# EAGLE design Version1 (EAGLE 6.2)
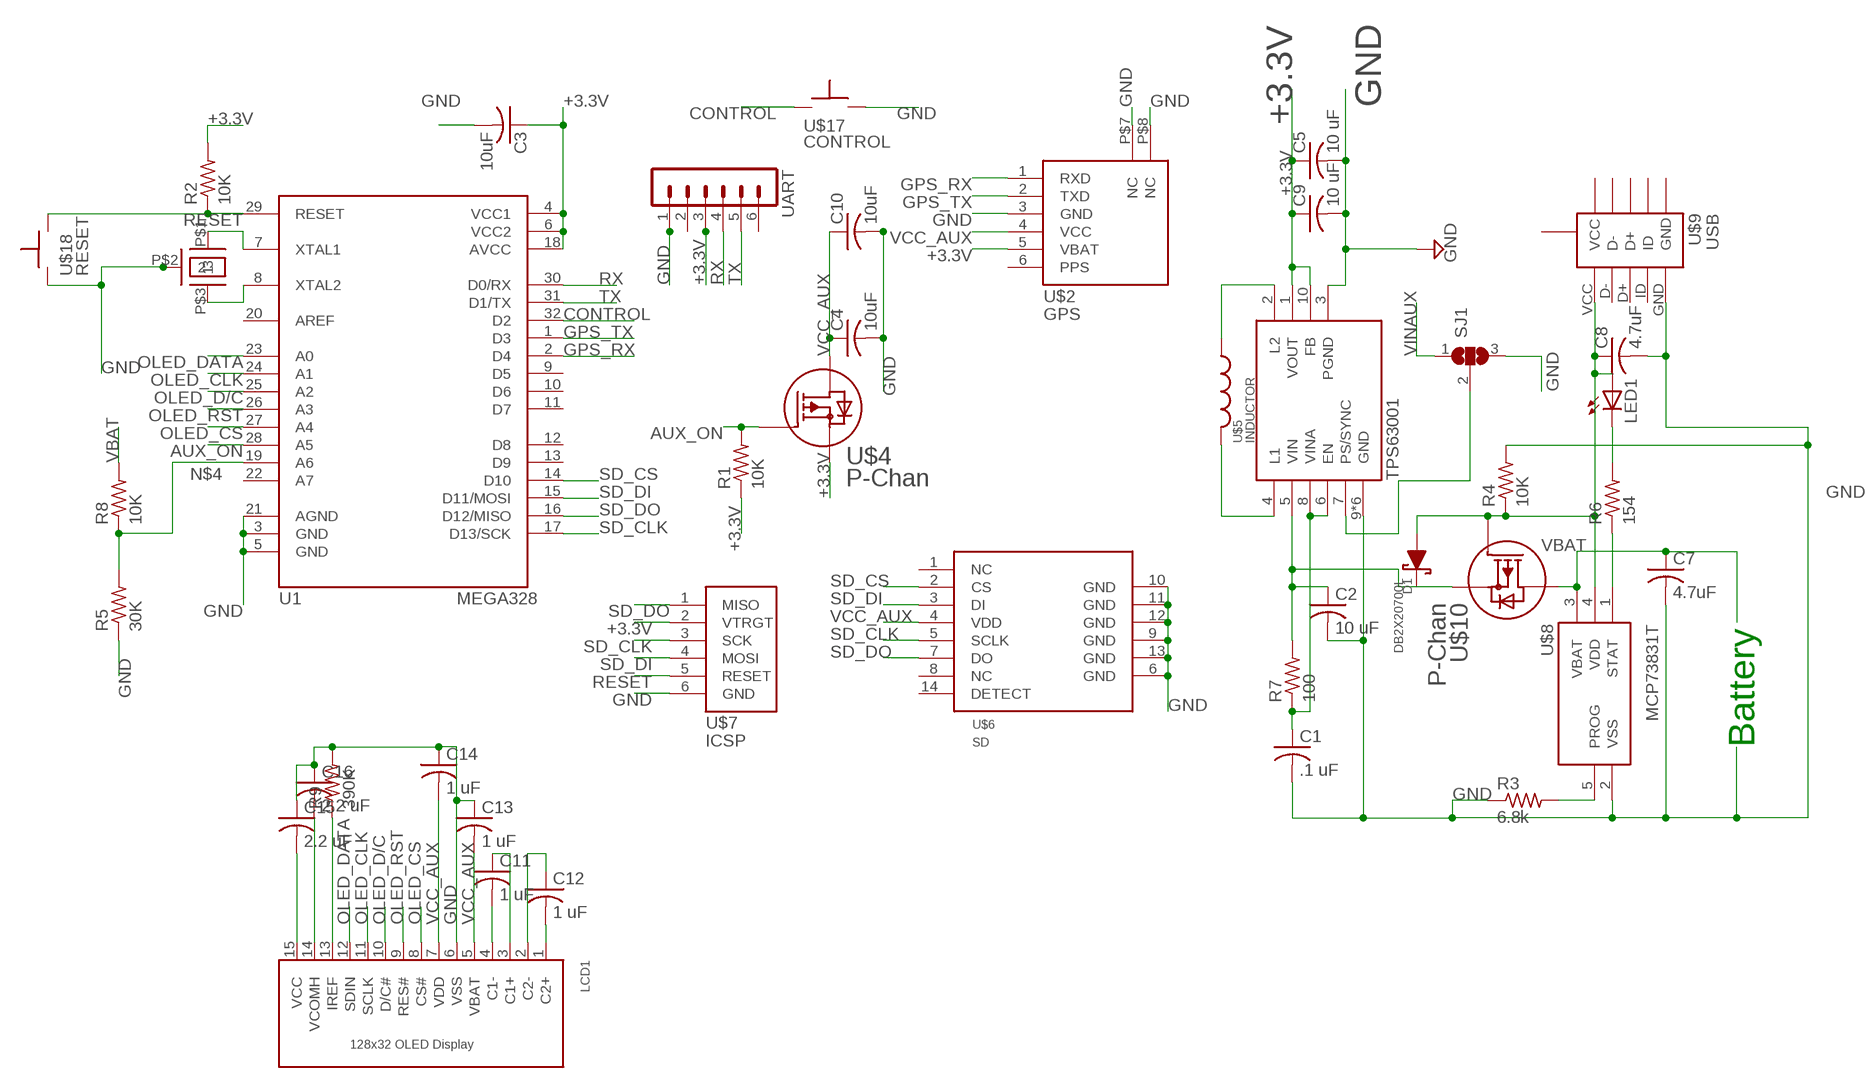
[diagram p0: schematic, sheet 1]

## Parts
C1  .1 uF  C-USC0603  [C0603]
C2  10 uF  C-USC0603  [C0603]
C3  10uF  C-USC0603  [C0603]
C4  10uF  C-USC0603  [C0603]
C5  10 uF  C-USC0603  [C0603]
C7  4.7uF  C-USC0603  [C0603]
C8  4.7uF  C-USC0603  [C0603]
C9  10 uF  C-USC0603  [C0603]
C10  10uF  C-USC0603  [C0603]
C11  1 uF  C-USC0805  [C0805]
C12  1 uF  C-USC0805  [C0805]
C13  1 uF  C-USC0805  [C0805]
C14  1 uF  C-USC0805  [C0805]
C15  2.2 uF  C-USC0805  [C0805]
C16  2.2 uF  C-USC0805  [C0805]
D1  DB2X20700L  DIODE-PANASONIC-DB2X20700LMINI2-F4-B  [MINI2-F4-B_DIODE]
LCD1  DISP_OLED_UG-2832HSWEG04WRAPAROUND  [UG-2832HSWEG04_WRAPAROUND]
LED1  LEDSMT1206  [1206]
R1  10K  R-US_R0805  [R0805]
R2  10K  R-US_R0805  [R0805]
R3  6.8k  R-US_R0805  [R0805]
R4  10K  R-US_R0805  [R0805]
R5  30K  R-US_R0805  [R0805]
R6  154  R-US_R0805  [R0805]
R7  100  R-US_R0603  [R0603]
R8  10K  R-US_R0805  [R0805]
R9  390K  R-US_R0805  [R0805]
SJ1  SJ2W  [SJ_2]
U1  MEGA328  ATMEGA328-TQFP32-ARDUINOARDUINO-LABELS  [MEGA328-TQFP32]
U$2  GPS  FASTRAX_UP501_GPS  [FASTRAX_GPS]
U$3  TPS63001  TPS63001-3.3V-BUCK/BOOSTSON-10  [SON-10]
U$4  P-Chan  NXP-MOSFET-PMV160UP,215  [SOT-23]
U$5  INDUCTOR  VLS3015-INDUCTORVLS-SERIES  [VLS3015E-INDUCTOR]
U$6  SD  MOLEX_MICROSD_502702-0891JAE  [JA-MICROSD-ST9S008V4AR1500]
U$7  ICSP  MOLEX2.54MM-6PIN-2X3ICSP  [2.54MM2X3]
U$8  MCP73831T  MICROCHIP-MCP73831-LIPO-CHARGERSOT-23-5  [SOT-23-5]
U$9  USB  MOLEX-MICRO-USB47346-0001  [MOLEX-MICRO-USB-47346-0001]
U$10  P-Chan  NXP-MOSFET-PMV160UP,215  [SOT-23]
U$12  OSC  MURATA-RESONATOR  [MURATA-8MHZ-RESONATOR]
U$17  CONTROL  SWITCH-OMRON-B3U-3000P  [SWITCH-SMALL]
U$18  RESET  SWITCH-OMRON-B3U-3000P  [SWITCH-SMALL]
UART  MA06-1  [MA06-1]

## Nets
+3.3V: C3.1 C5.1 C9.1 R1.1 R2.2 U1.4(VCC1) U1.6(VCC2) U1.18(AVCC) U$2.5(VBAT) U$3.1(VOUT) U$3.10(FB) U$4.2(SOURCE) U$7.2(VTRGT) UART.3
AUX_ON: R1.2 U1.28(A5) U$4.1(GATE)
CONTROL: U1.32(D2) U$17.P$1
GND: C1.2 C2.2 C3.2 C4.2 C5.2 C7.2 C8.2 C9.2 C10.2 C13.1 C14.1 C15.1 C16.1 LCD1.6(VSS) R3.1 R4.2 R5.1 R9.2 SJ1.3 U1.3(GND) U1.5(GND) U1.21(AGND) U$2.3(GND) U$2.P$7(NC) U$2.P$8(NC) U$3.3(PGND) U$3.9(GND) U$3.11(GND) U$3.12(GND) U$3.13(GND) U$3.14(GND) U$3.P$1(GND) U$6.6(GND) U$6.9(GND) U$6.10(GND) U$6.11(GND) U$6.12(GND) U$6.13(GND) U$7.6(GND) U$8.2(VSS) U$9.GND U$12.P$2 U$17.P$2 U$18.P$1 UART.1
GPS_RX: U1.2(D4) U$2.1(RXD)
GPS_TX: U1.1(D3) U$2.2(TXD)
L1: U$3.4(L1) U$5.1
L2: U$3.2(L2) U$5.2
N$1: R3.2 U$8.5(PROG)
N$2: U1.7(XTAL1) U$12.P$1
N$3: U1.8(XTAL2) U$12.P$3
N$4: R5.2 R8.1 U1.19(A6)
N$5: C11.2 LCD1.4(C1-)
N$6: C11.1 LCD1.3(C1+)
N$7: SJ1.2 U$3.7(PS/SYNC)
N$8: C12.1 LCD1.2(C2-)
N$9: C12.2 LCD1.1(C2+)
N$10: C15.2 LCD1.15(VCC)
N$11: C16.2 LCD1.14(VCOMH)
N$13: LCD1.13(IREF) R9.1
N$17: LED1.C R6.2
N$19: R6.1 U$8.1(STAT)
OLED_CLK: LCD1.11(SCLK) U1.24(A1)
OLED_CS: LCD1.8(CS#) U1.27(A4)
OLED_D/C: LCD1.10(D/C#) U1.25(A2)
OLED_DATA: LCD1.12(SDIN) U1.23(A0)
OLED_RST: LCD1.9(RES#) U1.26(A3)
RESET: R2.1 U1.29(RESET) U$7.5(RESET) U$18.P$2
RX: U1.30(D0/RX) UART.4
SD_CLK: U1.17(D13/SCK) U$6.5(SCLK) U$7.3(SCK)
SD_CS: U1.14(D10) U$6.2(CS)
SD_DI: U1.15(D11/MOSI) U$6.3(DI) U$7.4(MOSI)
SD_DO: U1.16(D12/MISO) U$6.7(DO) U$7.1(MISO)
TX: U1.31(D1/TX) UART.5
VBAT: C7.1 R8.2 U$8.3(VBAT) U$10.3(DRAIN)
VCC_AUX: C4.1 C10.1 C13.2 C14.2 LCD1.5(VBAT) LCD1.7(VDD) U$2.4(VCC) U$4.3(DRAIN) U$6.4(VDD)
VDD: C8.1 D1.ANODE(A) LED1.A R4.1 U$8.4(VDD) U$9.VCC U$10.1(GATE)
VIN: C2.1 D1.CATHODE(K) R7.2 U$3.5(VIN) U$10.2(SOURCE)
VINAUX: C1.1 R7.1 SJ1.1 U$3.6(EN) U$3.8(VINA)
Unconnected: U1.9(D5) U1.10(D6) U1.11(D7) U1.12(D8) U1.13(D9) U1.20(AREF) U1.22(A7) U$2.6(PPS) U$6.1(NC) U$6.8(NC) U$6.14(DETECT) U$9.D+ U$9.D- U$9.GND@6(GND) U$9.GND@7(GND) U$9.GND@8(GND) U$9.GND@9(GND) U$9.GND@10(GND) U$9.GND@11(GND) U$9.ID UART.2 UART.6

## Notes on the sheet
- Battery

## Library data of the parts
C1-C5 C7-C10 = rcl:C-US: CAPACITOR, American symbol
C11-C16 = resistor:C-US: CAPACITOR, American symbol
D1 = Saleem_lib:DIODE-PANASONIC-DB2X20700L
LCD1 = microbuilder:DISP_OLED_UG-2832HSWEG04: 128x32 SPI 0.91" Monochrome OLED Display
LED1 = led:LED: LED OSRAM: - CHIPLED LG R971, LG N971, LY N971, LG Q971, LY Q971, LO R971, LY R971 LH N974, LH R974 LS Q976, LO Q976, LY Q976 LO Q996 - Hyper CHIPLED LW Q18S LB Q993, LB Q99A, LB R99A - SideLED LS A670, LO A670, LY A670, LG A670, LP A670 LB A673, LV A673, LT A673, LW A673 LH A674 LY A675 LS A676, LA A676, LO A676, LY A676, LW A676 LS A679, LY A679, LG A679 - Hyper Micro SIDELED® LS Y876, LA Y876, LO Y876, LY Y876 LT Y87S - SmartLED LW L88C, LW L88S LB L89C, LB L89S, LG L890 LS L89K, LO L89K, LY L89K LS L896, LA L896, LO L896, LY L896 - TOPLED LS T670, LO T670, LY T670, LG T670, LP T670 LSG T670, LSP T670, LSY T670, LOP T670, LYG T670 LG T671, LOG T671, LSG T671 LB T673, LV T673, LT T673, LW T673 LH T674 LS T676, LA T676, LO T676, LY T676, LB T676, LH T676, LSB T676, LW T676 LB T67C, LV T67C, LT T67C, LS T67K, LO T67K, LY T67K, LW E67C LS E67B, LA E67B, LO E67B, LY E67B, LB E67C, LV E67C, LT E67C LW T67C LS T679, LY T679, LG T679 LS T770, LO T770, LY T770, LG T770, LP T770 LB T773, LV T773, LT T773, LW T773 LH T774 LS E675, LA E675, LY E675, LS T675 LS T776, LA T776, LO T776, LY T776, LB T776 LHGB T686 LT T68C, LB T68C - Hyper Mini TOPLED® LB M676 - Mini TOPLED Santana® LG M470 LS M47K, LO M47K, LY M47K Source: http://www.osram.convergy.de LUXEON: - LUMILED® LXK2-PW12-R00, LXK2-PW12-S00, LXK2-PW14-U00, LXK2-PW14-V00 LXK2-PM12-R00, LXK2-PM12-S00, LXK2-PM14-U00 LXK2-PE12-Q00, LXK2-PE12-R00, LXK2-PE12-S00, LXK2-PE14-T00, LXK2-PE14-U00 LXK2-PB12-K00, LXK2-PB12-L00, LXK2-PB12-M00, LXK2-PB14-N00, LXK2-PB14-P00, LXK2-PB14-Q00 LXK2-PR12-L00, LXK2-PR12-M00, LXK2-PR14-Q00, LXK2-PR14-R00 LXK2-PD12-Q00, LXK2-PD12-R00, LXK2-PD12-S00 LXK2-PH12-R00, LXK2-PH12-S00 LXK2-PL12-P00, LXK2-PL12-Q00, LXK2-PL12-R00 Source: www.luxeon.com KINGBRIGHT: KA-3528ASYC Source: www.kingbright.com
R1-R8 = resistor:R-US_: RESISTOR, American symbol
R9 = adafruit:R-US_: RESISTOR, American symbol
SJ1 = jumper:SJ2W: SMD solder JUMPER
U1 = Saleem_lib:ATMEGA328-TQFP32-ARDUINO: 556-ATMEGA328P-AU
U$2 = Saleem_lib:FASTRAX_UP501_GPS
U$3 = Saleem_lib:TPS63001-3.3V-BUCK/BOOST
U$4 U$10 = Saleem_lib:NXP-MOSFET-PMV160UP,215
U$5 = Saleem_lib:VLS3015-INDUCTOR
U$6 = Saleem_lib:MOLEX_MICROSD_502702-0891
U$7 = Saleem_lib:MOLEX2.54MM-6PIN-2X3
U$8 = Saleem_lib:MICROCHIP-MCP73831-LIPO-CHARGER
U$9 = Saleem_lib:MOLEX-MICRO-USB
U$12 = Saleem_lib:MURATA-RESONATOR
U$17 U$18 = Saleem_lib:SWITCH-OMRON-B3U-3000P
UART = con-lstb:MA06-1: PIN HEADER; OC_FARNELL: unknown; OC_NEWARK: unknown

## Board
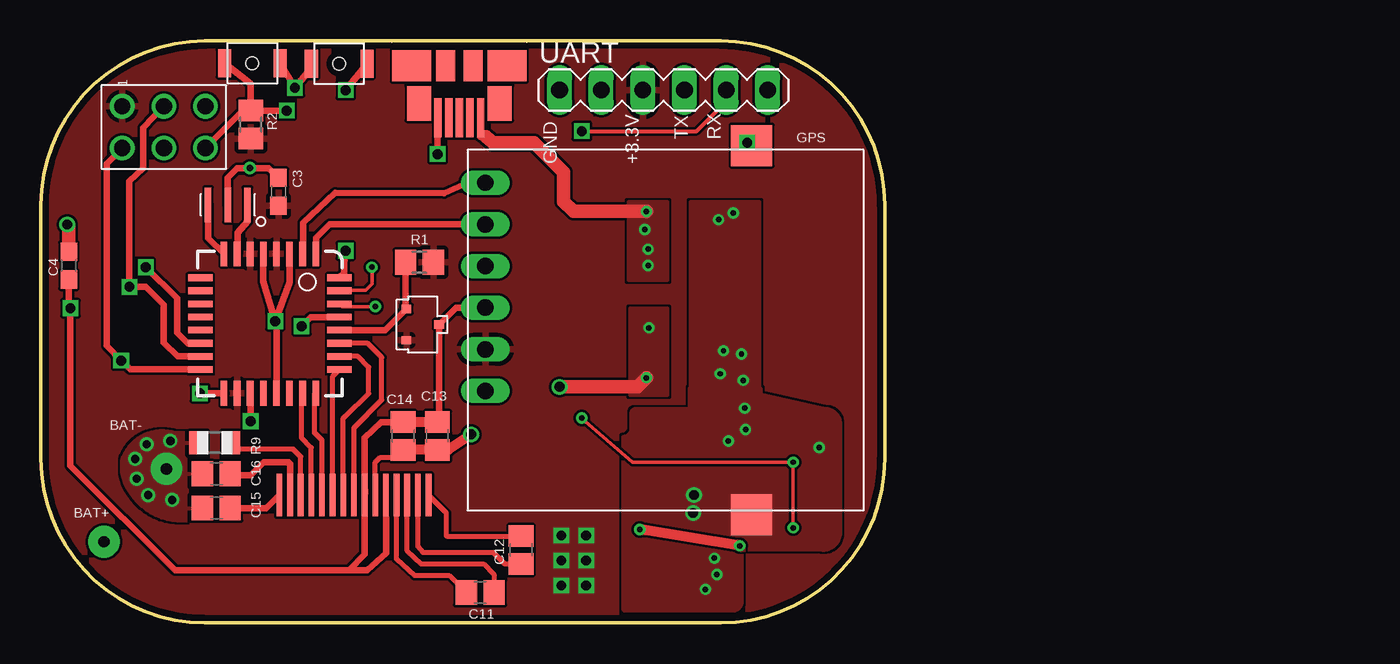
[diagram p1: board, top side]
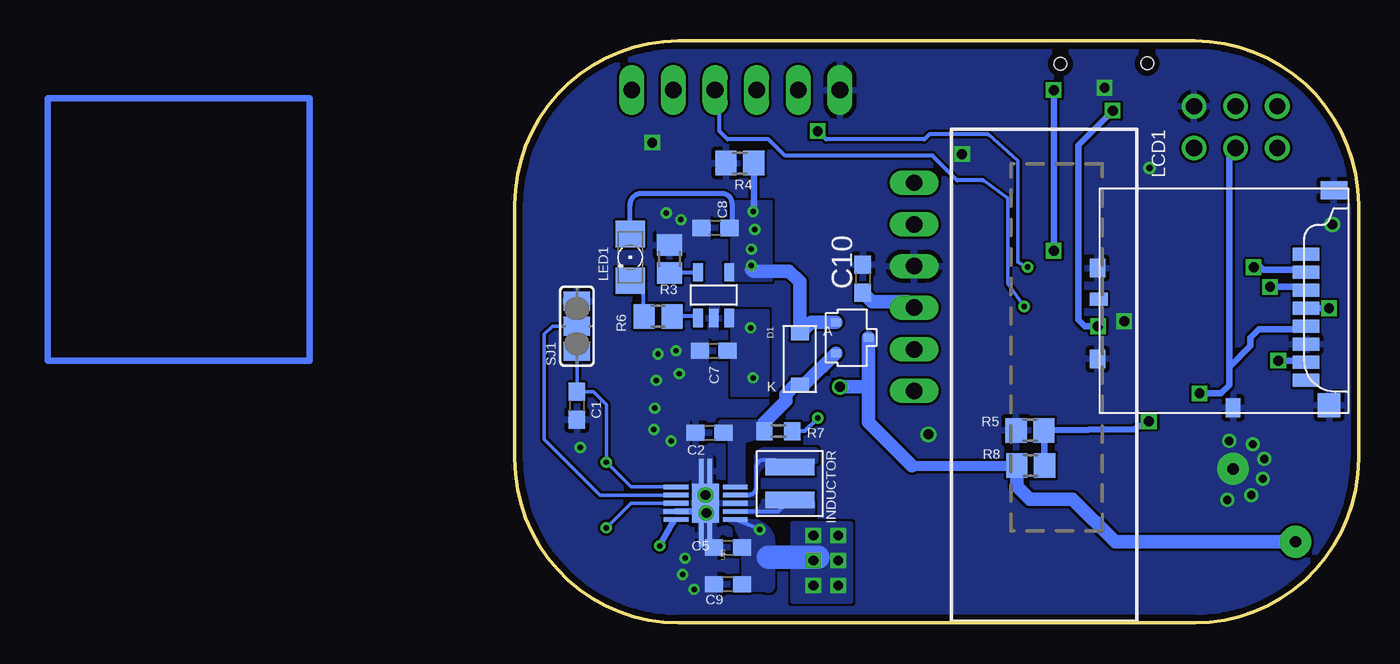
[diagram p2: board, bottom side, seen from below]

Size 51.5 x 35.5 mm. Coordinates in mm from the lower left corner, seen from the top.
Outline: 41.5,35.5 10,35.5 arc90 0,25.5 0,10 arc90 10,0 41.5,0 arc90 51.5,10 51.5,25.5 arc90 41.5,35.5
Copper layers (1*16): Top 0.0356mm / dielectric 1.5011mm / Bottom 0.0356mm
Design rules: minimum track width 6mil, minimum drill 13mil, track to track 6mil, track to pad 6mil, pad to pad 6mil, via to via 6mil, smd to smd 6mil, copper to edge 15mil, drill to drill 6mil, minimum pad ring 7mil, minimum via ring 7mil, stop-mask expansion 0mil, vias tented up to drill 24mil, thermal gap 10mil

### Footprints (pad centres in the part's own frame; a part is rotated, then mirrored left to right if it is on the bottom)
C0603 = smd 1.1 x 1: 1 -0.85,0; 2 0.85,0
C0805 = smd 1.3 x 1.5: 1 -0.85,0; 2 0.85,0
MINI2-F4-B_DIODE = smd 1.1 x 0.8: ANODE 0,-1.55; CATHODE 0,1.55
UG-2832HSWEG04_WRAPAROUND = smd 2.6 x 0.35 bottom: 1 -7.7,-4.55; 2 -7.7,-3.9; 3 -7.7,-3.25; 4 -7.7,-2.6; 5 -7.7,-1.95; 6 -7.7,-1.3; 7 -7.7,-0.65; 8 -7.7,0; 9 -7.7,0.65; 10 -7.7,1.3; 11 -7.7,1.95; 12 -7.7,2.6; 13 -7.7,3.25; 14 -7.7,3.9; 15 -7.7,4.55
1206 = smd 1.6 x 1.803: A -1.422,0; C 1.422,0
R0805 = smd 1.3 x 1.5: 1 -0.85,0; 2 0.85,0
R0603 = smd 1 x 1.1: 1 -0.85,0; 2 0.85,0
R0805' = smd 1.1 x 1.4: 1 -1,0; 2 1,0
SJ_2 = smd 1.168 x 1.6: 1 -1.524,0; 2 0,0; 3 1.524,0
MEGA328-TQFP32 = smd 1.5 x 0.406: 1 -4.25,2.8; 2 -4.25,2; 3 -4.25,1.2; 4 -4.25,0.4; 5 -4.25,-0.4; 6 -4.25,-1.2; 7 -4.25,-2; 8 -4.25,-2.8; 17 4.25,-2.8; 18 4.25,-2; 19 4.25,-1.2; 20 4.25,-0.4; 21 4.25,0.4; 22 4.25,1.2; 23 4.25,2; 24 4.25,2.8 | smd 0.406 x 1.5: 9 -2.8,-4.25; 10 -2,-4.25; 11 -1.2,-4.25; 12 -0.4,-4.25; 13 0.4,-4.25; 14 1.2,-4.25; 15 2,-4.25; 16 2.8,-4.25; 25 2.8,4.25; 26 2,4.25; 27 1.2,4.25; 28 0.4,4.25; 29 -0.4,4.25; 30 -1.2,4.25; 31 -2,4.25; 32 -2.8,4.25
FASTRAX_GPS = drill 1 long: 1 11.43,-8.89; 2 11.43,-6.35; 3 11.43,-3.81; 4 11.43,-1.27; 5 11.43,1.27; 6 11.43,3.81 | smd 2.5 x 2.5: P$7 -4.82,11.35; P$8 -4.82,-11.16
SON-10 = smd 0.28 x 1.5: 1 -1,-1.8; 2 -0.5,-1.8; 3 0,-1.8; 4 0.5,-1.8; 5 1,-1.8; 6 1,1.8; 7 0.5,1.8; 8 0,1.8; 9 -0.5,1.8; 10 -1,1.8 | smd 1.5 x 0.28: 11 -1.95,0.25; 12 -1.95,-0.25; 13 1.95,0.25; 14 1.95,-0.25 | smd 2.4 x 1.65: P$1 0,0
SOT-23 = smd 0.5 x 0.6: 1 0.95,0.7; 2 -0.95,0.7; 3 0,-1.3
VLS3015E-INDUCTOR = smd 1 x 3: 1 -1,0; 2 1,0
JA-MICROSD-ST9S008V4AR1500 = smd 0.8 x 1.6: 1 3,-6.1; 2 1.9,-6.1; 3 0.8,-6.1; 4 -0.3,-6.1; 5 -1.4,-6.1; 6 -2.5,-6.1; 7 -3.6,-6.1; 8 -4.7,-6.1 | smd 1.45 x 1.4: 9 -6.225,-7.5 | smd 1.1 x 1.6: 10 6.9,-7.8 | smd 1.1 x 0.95: 11 -3.4,6.625; 12 2.15,6.625 | smd 1.15 x 0.9: 13 -6.375,-1.65 | smd 0.8 x 1.1: 14 0.25,6.55
2.54MM2X3 = drill 1: 1 -1.27,2.54; 2 1.27,2.54; 3 -1.27,0; 4 1.27,0; 5 -1.27,-2.54; 6 1.27,-2.54
SOT-23-5 = smd 0.6 x 1.1: 1 -0.95,0; 2 0,0; 3 0.95,0; 4 0.95,2.8; 5 -0.95,2.8
MOLEX-MICRO-USB-47346-0001 = smd 2.38 x 0.45: D+ 0.5,0; D- 0.5,0.65; GND 0.5,-1.3; ID 0.5,-0.65; VCC 0.5,1.3 | smd 2.1 x 1.475: GND@6 -0.36,2.462; GND@7 -0.36,-2.462 | smd 1.9 x 2.375: GND@8 -2.66,2.913; GND@11 -2.66,-2.913 | smd 1.9 x 1.175: GND@9 -2.66,0.838; GND@10 -2.66,-0.838
MURATA-8MHZ-RESONATOR = smd 0.4 x 2.1: P$1 -1.2,0; P$2 0,0; P$3 1.2,0
SWITCH-SMALL = smd 0.8 x 1.7: P$1 -1.7,0; P$2 1.7,0 | hole 0.75: 0,0
MA06-1 = drill 1.016 long: 1 -6.35,0; 2 -3.81,0; 3 -1.27,0; 4 1.27,0; 5 3.81,0; 6 6.35,0

### Placement (x,y rotation side)
C1  47.7,13.25 270 bottom
C2  39.6,11.6 180 bottom
C3  14.5,26.3 90 top
C4  1.7,21.8 90 top
C5  38.49,4.6 180 bottom
C7  39.35,16.6 180 bottom
C8  39.25,24.1 180 bottom
C9  38.47,2.36 180 bottom
C10  30.25,21 90 bottom
C11  26.8,1.85 180 top
C12  29.3,4.45 90 top
C13  24.2,11.4 90 top
C14  22.1,11.4 90 top
C15  10.7,7 0 top
C16  10.7,9.1 0 top
D1  34.1,16.1 180 bottom
LCD1  19.1,0.1 270 bottom
LED1  44.45,22.3 270 bottom
R1  23.1,22 180 top
R2  12.8,30.4 270 top
R3  42.05,22.2 270 bottom
R4  37.75,28.05 180 bottom
R5  20.05,11.75 0 bottom
R6  42.75,18.7 180 bottom
R7  35.4,11.7 180 bottom
R8  20,9.6 180 bottom
R9  390K  [R0805']  10.6,11 180 top
SJ1  47.7,18.1 90 bottom
U1  13.97,18.26 270 top
U$2  38.55,17.96 180 top
U$3  39.85,7.3 90 bottom
U$4  23,18.2 90 top
U$5  34.7,8.5 270 bottom
U$6  9.3,19.5 90 bottom
U$7  7.5,30.25 90 top
U$8  39.35,18.6 0 bottom
U$9  25.53,31.33 270 top
U$10  31.2,17.4 90 bottom
U$12  11.4,25.5 180 top
U$17  18.2,34.12 180 top
U$18  12.9,34.14 180 top
UART  38,32.5 0 top

### Tracks (layer width: path | path; a pad name or v marks a point on that pad's centre or on a via)
+3.3V  (via drill 0.33, 0.6)
  Top 0.61: v42.65,4.7 v36.55,5.7
  Bottom 0.152: U$3.10 41.86,6.3 41.86,6.1
  Bottom 0.254: v36.55,5.7 U$3.1
  Bottom 0.406: 41.85,6.1 41.86,6.1 v42.65,4.7
  Bottom 1.422: 33,4 36,4
  other vias: 31.75,5.33 31.75,3.81 31.75,2.29 33.27,5.33 33.27,3.81 33.27,2.29
  pour Top (rank 6): -0.5,22 -0.5,36 52,36 52,-0.5 -0.5,-0.5
  pour Bottom (no thermals): 38.35,6.25 37.05,6.2 arc90 35.75,4.9 35.78,2.17 arc90 36.1,1.99 37.28,2.02 arc90 37.49,2.14 37.5,5.45 arc90 37.7,5.25 37.9,5.65 arc-90 38.35,6.2
  pour Bottom: 34.54,1.27 34.54,6.1 30.99,6.1 30.99,1.27
AUX_ON
  Top 0.406: R1.2 22.25,19.2 U$4.1 21.01,17.86 U1.28
CONTROL  (via drill 0.6)
  Top 0.406: U1.32 18.36,21.2 18.5,21.3 18.5,21.9 v18.6,22.7 | v18.6,32.5 U$17.P$1
  Bottom 0.406: v18.6,22.7 v18.6,32.5
GND  (via drill 0.33, 0.4, 0.5 pad 0.41, 0.6, 0.7 pad 1.93)
  Top 0.305: LCD1.6 20.4,9.8 20.7,10.1 21.65,10.1 C14.1 | C13.1 24.85,10.55
  Top 0.406: U$2.P$8 43.19,29.3 v43.1,29.3 | 15.35,32.65 v15.5,32.65 | U$17.P$2 16.15,33.45 v15.5,32.65 | U$9.GND 24.2,31.3 v24.2,28.6 | U1.5 13.57,20.83 v14.3,18.4 | U1.3 15.17,20.77 v14.3,18.4 | U$12.P$2 11.4,27.17 11.98,27.75 v12.75,27.75 13.9,27.75 C3.2 | U1.21 14.37,18.33 v14.3,18.4 | U$18.P$1 v15.5,32.65
  Top 0.61: C13.1 C14.1 | 24.85,10.55 v26.25,11.5
  Top 0.813: C4.2 1.7,24.2 v1.6,24.3
  Bottom 0.406: U$3.9 39.85,6.8 U$3.P$1
  other vias: 42.85,14.8 42.75,16.4 41.65,16.6 42.25,25 41.35,24.6 41.45,15.2 43,11.8 42.95,13.1 41.95,11.1 39.85,7.8 39.8,6.7 41.1,3.95 41.25,2.95 40.55,2.05 47.5,10.7 7.65,9.4 7.9,11.1 8,7.5 6.45,10.9 5.75,10 5.85,8.8 6.55,7.8
  pour Bottom (no thermals): 39.15,18.2 39.15,17.5 39.75,17.5 39.75,13.9 43.85,13.9 43.85,17.7 39.65,17.7 39.65,18.2
  pour Bottom (no thermals): 39.55,19 39.55,22.7 42.75,22.7 42.75,25.7 39.65,25.7 39.65,23.2 39.05,23.2 39.05,19
  pour Top (isolate 0.254): 43.85,13.9 43.85,25.7 39.65,25.7 39.65,13.9
  pour Bottom (no thermals): 39.15,8.35 arc90 39.5,8.7 39.5,10.6 arc-90 39.6,10.7 40.85,10.7 arc90 40.9,10.75 40.9,15.55 arc-90 40.95,15.6 43.9,15.6 arc-90 43.95,15.55 44,10.35 42.2,10 arc90 40.6,9 40.6,8.45 arc-90 40.3,8.15 39.15,8.15
  pour Bottom (no thermals): 39.4,6.25 arc90 39.3,6.15 39.3,2.3 arc90 40.55,1.05 41.25,1.05 arc90 42.5,2.3 42.5,3.95 arc90 41.7,4.75 40.5,4.75 arc-90 40.2,5.05 40.2,6.15 arc90 39.35,6.25
  pour Top (no thermals): 36.05,12.8 arc-90 36.3,13.05 39.6,13.05 39.6,14.3 43.9,14.3 43.9,13.95 47.85,13.05 arc-90 48.75,12.15 48.75,5.5 arc-90 47.7,4.45 43,4.45 arc90 42.75,4.2 42.75,1.3 arc-90 42.2,0.75 35.65,0.75 arc-90 35.55,0.85 35.55,11.35 arc90 36.05,11.85
  pour Bottom (rank 6): -1,36.5 52.5,36.5 52.5,-1 -1,-1
  pour Top: 9.4,6.3 arc-90 4.95,9.2 4.95,9.9 arc-90 8.2,11.6 9.1,11.6
GPS_RX
  Top 0.406: U$2.1 26.05,26.85 24.6,26.2 17.95,26.25 16,24.4 16,22.51 U1.2
GPS_TX
  Top 0.406: U$2.2 17.61,24.31 16.8,23.5 16.8,22.54 U1.1
L1
  Bottom 0.254: U$3.4 37.25,7.8 arc-90 36.75,8.3 36.75,9.5 arc90 36.3,9.95 35.6,9.95 arc-90 35.15,9.5 U$5.1
  pour Bottom (no thermals): 37.2,7.75 37.1,7.75 arc-90 36.75,8.05 36.75,8.75 arc90 35.7,9.8 33.2,9.8 arc-90 33.05,9.95 33.05,10.45 arc-90 33.2,10.6 36.2,10.6 arc-90 36.8,10 36.8,8.15 arc90 37.1,7.85 37.2,7.85
L2
  Bottom 0.254: U$3.2 35.4,6.8 U$5.2
  pour Bottom (no thermals): 37.2,6.75 33.3,6.75 arc-90 33.25,6.8 33.25,7.3 arc-90 33.4,7.45 36.35,7.45 arc90 36.95,6.85 37.2,6.85 arc-90 37.25,6.8
N$1
  Bottom 0.203: 42.05,21.4 R3.2
  Bottom 0.254: 42.05,21.4 U$8.5
N$2
  Top 0.406: U1.7 12,22.58 12,23.8 12.6,24.5 U$12.P$1
N$3
  Top 0.406: U1.8 10.2,23.48 U$12.P$3
N$4  (via drill 0.6)
  Top 0.406: v12.8,12.3 12.8,13.98 U1.19
  Bottom 0.406: R8.1 R5.2 13.7,11.8 v12.8,12.3
N$5
  Top 0.305: C11.2 24.9,2.9 22.8,2.9 21.7,3.9 LCD1.4
N$6
  Top 0.305: C11.1 27.65,2.95 27,3.6 23.2,3.6 22.35,4.4 LCD1.3
N$7
  Bottom 0.203: U$3.7 46.3,7.8 49.7,11.2 49.7,17.6 49.2,18.1 SJ1.2
N$8
  Top 0.305: C12.1 28.3,3.6 27.6,4.3 23.3,4.3 23,4.65 LCD1.2
N$9
  Top 0.305: C12.2 24.75,5.3 24.75,6.7 LCD1.1
N$10
  Top 0.406: C15.2 13.75,7 LCD1.15
N$11
  Top 0.305: LCD1.14 15.2,9.15
  Top 0.406: 15.2,9.15 15.2,9.7 15.1,9.8 13.6,9.8 12.8,9 11.65,9 C16.2
N$12
  Bottom 0.406: 64,32 80,32 80,16 64,16 64,32
N$13
  Top 0.305: LCD1.13 15.85,10.15 15.4,10.6 12,10.6 R9.1
N$17
  Bottom 0.203: 43.65,20.88 LED1.C
  Bottom 0.254: R6.2 43.65,20.88
N$19
  Bottom 0.203: U$8.1 40.3,18.7
  Bottom 0.254: 40.3,18.7 R6.1
OLED_CLK
  Top 0.305: LCD1.11 17.15,11.15 16.7,11.6 16.7,13.94 U1.24
OLED_CS
  Top 0.305: U1.27 19.94,17.06 20.8,16.2 20.8,13.6 19.1,11.9 LCD1.8
OLED_D/C
  Top 0.305: LCD1.10 17.8,15.04 U1.25
OLED_DATA
  Top 0.305: LCD1.12 16.5,10.7 15.9,11.3 15.9,13.94 U1.23
OLED_RST
  Top 0.305: U1.26 19.34,16.26 20,15.6 20,14 18.55,12.6 18.45,12.5 LCD1.9
RESET  (via drill 0.6)
  Top 0.406: v15.9,18.1 16.46,18.66 U1.29 | v15,31.25 R2.1 | R2.1 12.8,32.9 U$18.P$2 | 12.62,31.07 R2.1 | U$7.5 12.31,31.25 R2.1
  Bottom 0.406: v15.9,18.1 16.7,18.1 17.1,18.5 17.1,29.15 v15,31.25
RX  (via drill 0.33)
  Top 0.203: U1.30 18.38,19.3 v20.4,19.3
  Bottom 0.203: v20.4,19.3 21.4,20.7 21.4,25.9 22.9,27
  Bottom 0.254: 22.9,27 24.5,27 26,28.5 35,28.5 36,29.5 38.5,29.5 39,30 39,32.23 UART.4
SD_CLK  (via drill 0.6)
  Top 0.406: v9.7,14 U1.17
  Bottom 0.406: U$6.5 3.1,17.9 6.1,17.9 6.6,17.4 6.6,16.9 7.9,15.6 | 7.9,15.6 7.9,14.5 8.4,14 v9.7,14 | 7.9,15.6 7.9,28.58 U$7.3
SD_CS  (via drill 0.6)
  Top 0.406: v6.4,21.7 8.3,19.8 8.3,17.7 8.94,17.06 U1.14
  Bottom 0.406: U$6.2 3.35,21.55 5.8,21.55 5.95,21.7 v6.4,21.7
SD_DI  (via drill 0.6)
  Top 0.406: U1.15 8.34,16.26 7.5,17.1 7.5,19.4 6.4,20.5 v5.4,20.5 5.4,26.95 6.25,27.75 6.25,30.22 U$7.4
  Bottom 0.406: U$6.3 3.4,20.5 v5.4,20.5
SD_DO  (via drill 0.6)
  Top 0.406: U1.16 5.44,15.46 v4.9,16 4,16.9 4,28.02 U$7.1
  Bottom 0.406: U$6.7 3,16 v4.9,16
TX  (via drill 0.33, 0.6)
  Top 0.203: U1.31 18.26,20.3 19.8,20.3 20.2,20.7 v20.2,21.7
  Top 0.254: v33,30 40,30 41.5,31.5 41.5,32.19 UART.5
  Bottom 0.203: v20.2,21.7 20.8,22 20.8,28.2 22.6,29.8
  Bottom 0.254: 22.6,29.8 26.2,29.8 26.5,29.5 32.5,29.5 v33,30
VBAT  (via drill 0.33, 0.6, 0.7 pad 1.93)
  Top 0.813: v31.65,14.4 36.4,14.4 v36.95,14.95
  Bottom 0.61: 27.25,9.6 R8.2
  Bottom 0.813: U$10.3 29.9,14.5 | 29.9,14.5 29.9,12.25 27.25,9.6 | R8.2 20.85,8.35 20.05,7.55 17.45,7.55 14.85,4.95 v3.85,4.95 | v31.65,14.4 30,14.4 29.9,14.5
  other vias: 37.1,18
  pour Bottom (no thermals): 38.25,19.05 36.05,19.05 36.05,13.9 38.25,13.9
  pour Top: 35.95,13.9 35.95,19.2 38.25,19.2 38.25,13.9
  pour Bottom (no thermals): 37.8,8.3 arc-90 38.05,8.3
VCC_AUX  (via drill 0.6)
  Top 0.305: 19.75,6.4 LCD1.7 19.8,7.85 19.75,9.2 | LCD1.5 21.05,6.4 | 24.3,12.35 C13.2
  Top 0.406: C4.1 1.7,19.3 v1.8,19.2 1.8,9.6 8.2,3.2 18.8,3.2 | U$2.4 25.33,19.23 U$4.3 24.3,12.35 | 18.8,3.2 19.9,3.2 21.05,4.25 21.05,6.4 | 18.8,3.2 19.75,4.2 19.75,6.4 | C14.2 20.75,12.25 19.75,11.3 19.75,9.2
  Top 0.61: C13.2 C14.2
  Bottom 0.406: U$6.4 v1.8,19.2
  Bottom 0.813: C10.1 29.7,19.6 27.49,19.6 U$2.4
VDD  (via drill 0.33)
  Top 0.406: U$9.VCC 26.8,31.3 26.8,29.65 27.15,29.65
  Top 0.813: 27.15,29.65 27.6,29.3 30.1,29.3 31.9,27.5 31.9,25.7 32.5,25.1 v36.95,25.1
  Bottom 0.305: LED1.A 44.45,25.53 arc90 43.78,26.2 38.84,26.2 arc90 38.25,25.61 38.25,24.1
  Bottom 0.406: R4.1 36.9,25.15 v36.95,25.1
  Bottom 0.813: 37.05,21.55 36.95,21.45 34.75,21.45 34.1,20.8 D1.ANODE 33.4,18.35 U$10.1
  other vias: 37.05,22.8 36.85,24 37.05,21.8
  pour Bottom (no thermals): 38.25,20.9 38.25,25.7 35.85,25.7 35.85,20.9
  pour Top: 35.85,20.9 35.85,25.7 38.25,25.7 38.25,20.9
VIN
  Bottom 0.61: 34.35,14.55 D1.CATHODE | 36.25,12.25 R7.2
  Bottom 0.813: U$10.2 33.8,14.55 D1.CATHODE | 34.35,14.55 34.95,13.95 34.95,13.55 36.25,12.25
  pour Bottom (no thermals): 37.6,8.4 37.6,11.1 36.3,11.5 36.35,12.2 38.9,12.2 38.9,11.3 38.3,11.3 38.3,8.4
VINAUX  (via drill 0.33)
  Top 0.203: v45.9,5.8 v45.9,9.8 36.1,9.8 v33,12.5
  Bottom 0.203: U$3.8 44.4,7.3 v45.9,5.8 | U$3.6 44.4,8.3 v45.9,9.8 45.9,13.3 46.7,14.1 C1.1 SJ1.1
  Bottom 0.254: v33,12.5 33.8,11.7 R7.1

### Text on the board
tPlace: 1
tNames: TX | RX | GND | +3.3V | BAT- | BAT+